# Altium schematic sheet power.SchDoc
size A4; SheetNumber: 2; SheetTotal: 3
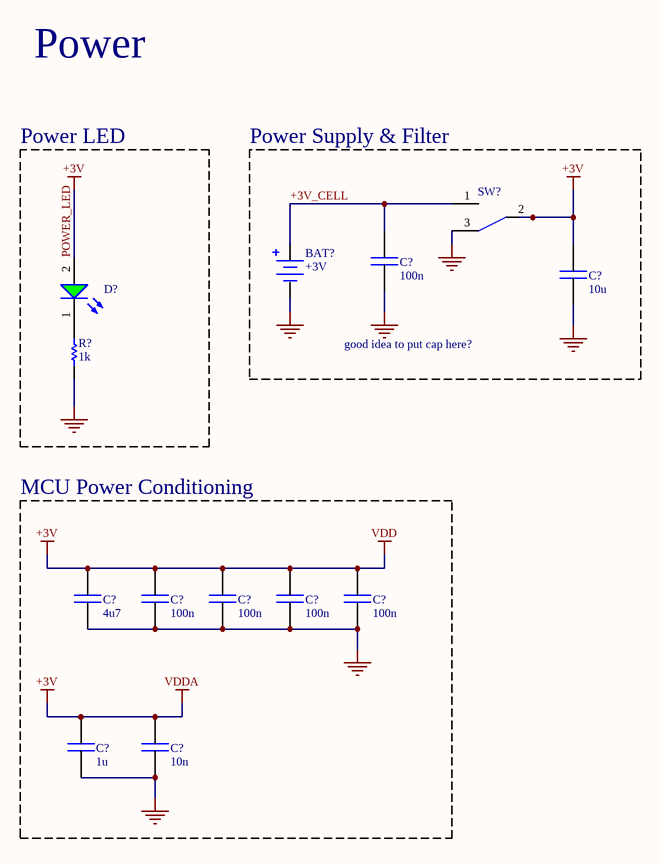
[diagram p0: power.SchDoc]

## Parts
(Parts that share a designator on the sheet are numbered #1, #2 ... from top to bottom, then left to right.)
BAT?  +3V
C?#1  100n
C?#2  10u
C?#3  4u7
C?#4  100n
C?#5  100n
C?#6  100n
C?#7  100n
C?#8  1u
C?#9  10n
D?  150060VS75000  [WL-SMCW_0603_150060xx75000]  (value not drawn)
R?  1k  [RESC1608X55X25LL10T15]
SW?  CJS-1200TB1  (value not drawn)

## Blocks framed on the sheet
Power LED: D? R?
Power Supply & Filter: BAT? C?#1 C?#2 SW?
MCU Power Conditioning: C?#3-C?#9

## Nets
GND: BAT?.1(-) C?#1.2 C?#2.2 C?#3.2 C?#4.2 C?#5.2 C?#6.2 C?#7.2 C?#8.2 C?#9.2 R?.1
POWER_LED: C?#2.1 C?#3.1 C?#4.1 C?#5.1 C?#6.1 C?#7.1 C?#8.1 C?#9.1 D?.2(A) SW?.2  [also labelled +3V, VDD, VDDA]
+3V_CELL: BAT?.2(+) C?#1.1
NetD?_1: D?.1(K) R?.2

Not connected (* = marked no-connect by the designer): SW? 1 3

## Notes on the sheet
- Power
- good idea to put cap here?

## Library data of the parts
BAT? = BH-67D-5: BATT RETAINER COIN 20MM 1CEL SMD; Supplier 1: Digi-Key; Supplier Part Number 1: 2057-BH-67D-5-ND
C?#1 C?#4-C?#7 = CAP_0.1uF_0603: CAP CER 0.1UF 50V X7R 0603; Supplier 1: Mouser; Supplier Part Number 1: 81-GCM188R71H104JA7D
C?#2 = CAP_10uF_0603: CAP CER 10UF 10V X7R 0603; Supplier 1: Arrow Electronics
C?#3 = CAP_4.7uF_0603: CAP CER 4.7UF 10V X7R 0603; Supplier 1: Digi-Key
C?#8 = CAP_1uF_0603: CAP CER 1UF 16V X7R 0603; Supplier 1: Arrow Electronics
C?#9 = CAP_10nF_0603: CAP CER 10000PF 100V X7R 0603; Supplier 1: Arrow Electronics; Supplier Part Number 1: GCM188R72A103KA37J
D? = CMP-1426-00006-6: NexarPartId: 29717778; Reverse Voltage: 5V; Forward Voltage: 2V; Viewing Angle: 140°; Luminous Intensity: 40mcd; Test Current: 20mA; Max Junction Temperature (Tj): 95°C; Wavelength: 570nm; Forward Current: 100mA; Color: Green; Lens Style: Clear, Rectangular; Power Dissipation: 72mW; Peak Wavelength: 572nm; Packaging: Tape and Reel; REACH SVHC: Unknown; Width: 800µm; Max Operating Temperature: 85°C; Number of Pins: 2; RoHS: Compliant; Dominant Wavelength: 570nm; Min Operating Temperature: -40°C; Case Code (Imperial): 0603; Height: 700µm; Length: 1.6mm; Case Code (Metric): 1608; Case/Package: 0603; Max Reverse Voltage (DC): 5V; Mount: Surface Mount
R? = CMP-2000-04305-1: Manufacturer: Yageo; Part Number: RC0603JR-101KL
SW? = CJS-1200TB1: SWITCH SLIDE SPDT 100MA 6V; Supplier 1: Avnet